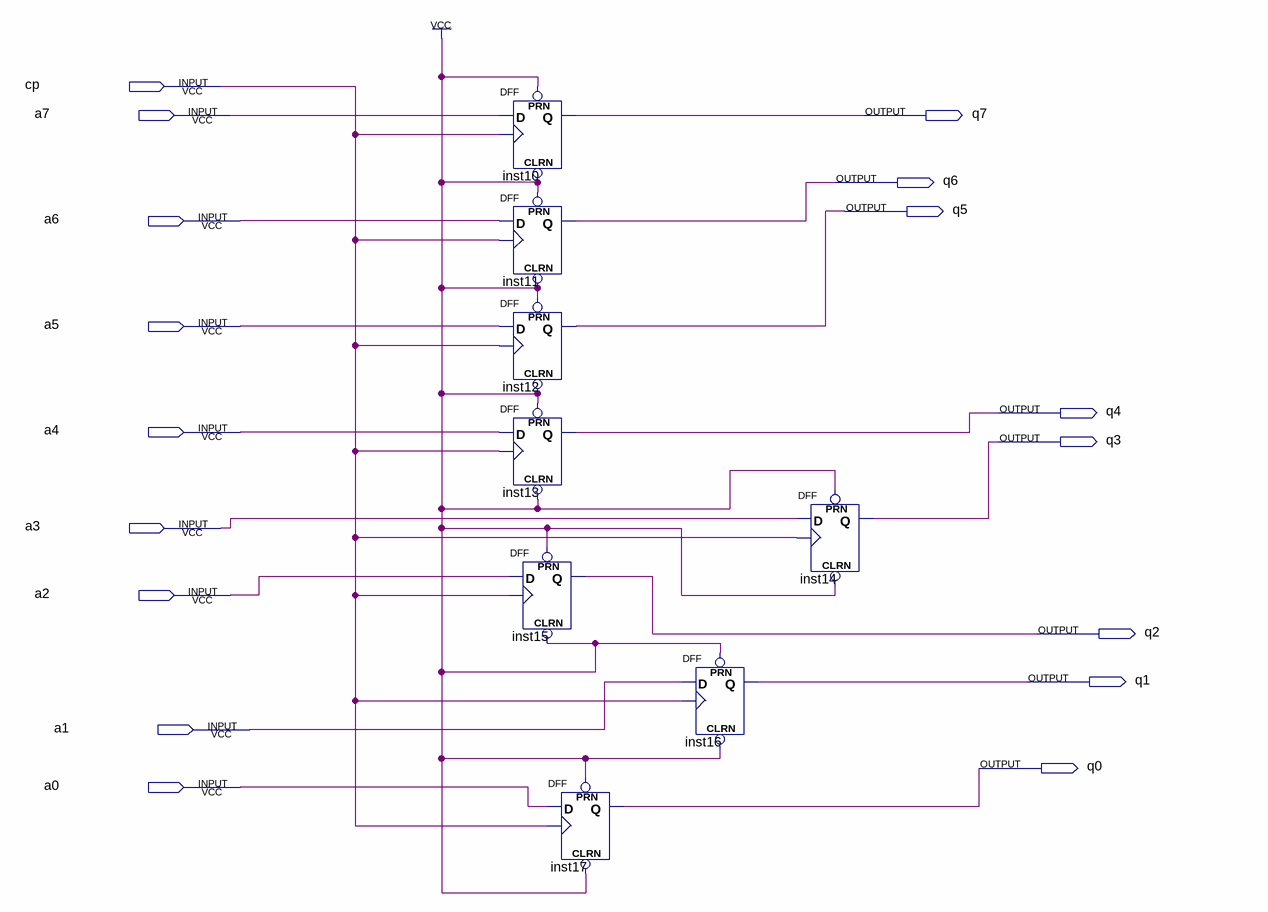
[diagram p0: schematic sheet]
// Quartus schematic jicunqi.bdf as structural Verilog: 8 symbols, 17 pins
module jicunqi (
  input  cp,
  input  a7,
  input  a6,
  input  a5,
  input  a4,
  input  a3,
  input  a2,
  input  a1,
  input  a0,
  output q7,
  output q6,
  output q5,
  output q4,
  output q3,
  output q2,
  output q1,
  output q0
);

  DFF inst10 (.CLRN(1'b1), .CLK(cp), .D(a7), .PRN(1'b1), .Q(q7));
  DFF inst11 (.CLRN(1'b1), .CLK(cp), .D(a6), .PRN(1'b1), .Q(q6));
  DFF inst12 (.CLRN(1'b1), .CLK(cp), .D(a5), .PRN(1'b1), .Q(q5));
  DFF inst13 (.CLRN(1'b1), .CLK(cp), .D(a4), .PRN(1'b1), .Q(q4));
  DFF inst15 (.CLRN(1'b1), .CLK(cp), .D(a2), .PRN(1'b1), .Q(q2));
  DFF inst17 (.CLRN(1'b1), .CLK(cp), .D(a0), .PRN(1'b1), .Q(q0));
  DFF inst16 (.CLRN(1'b1), .CLK(cp), .D(a1), .PRN(1'b1), .Q(q1));
  DFF inst14 (.CLRN(1'b1), .CLK(cp), .D(a3), .PRN(1'b1), .Q(q3));
endmodule
